# Altium project ESP32_USB_C.PrjPcb
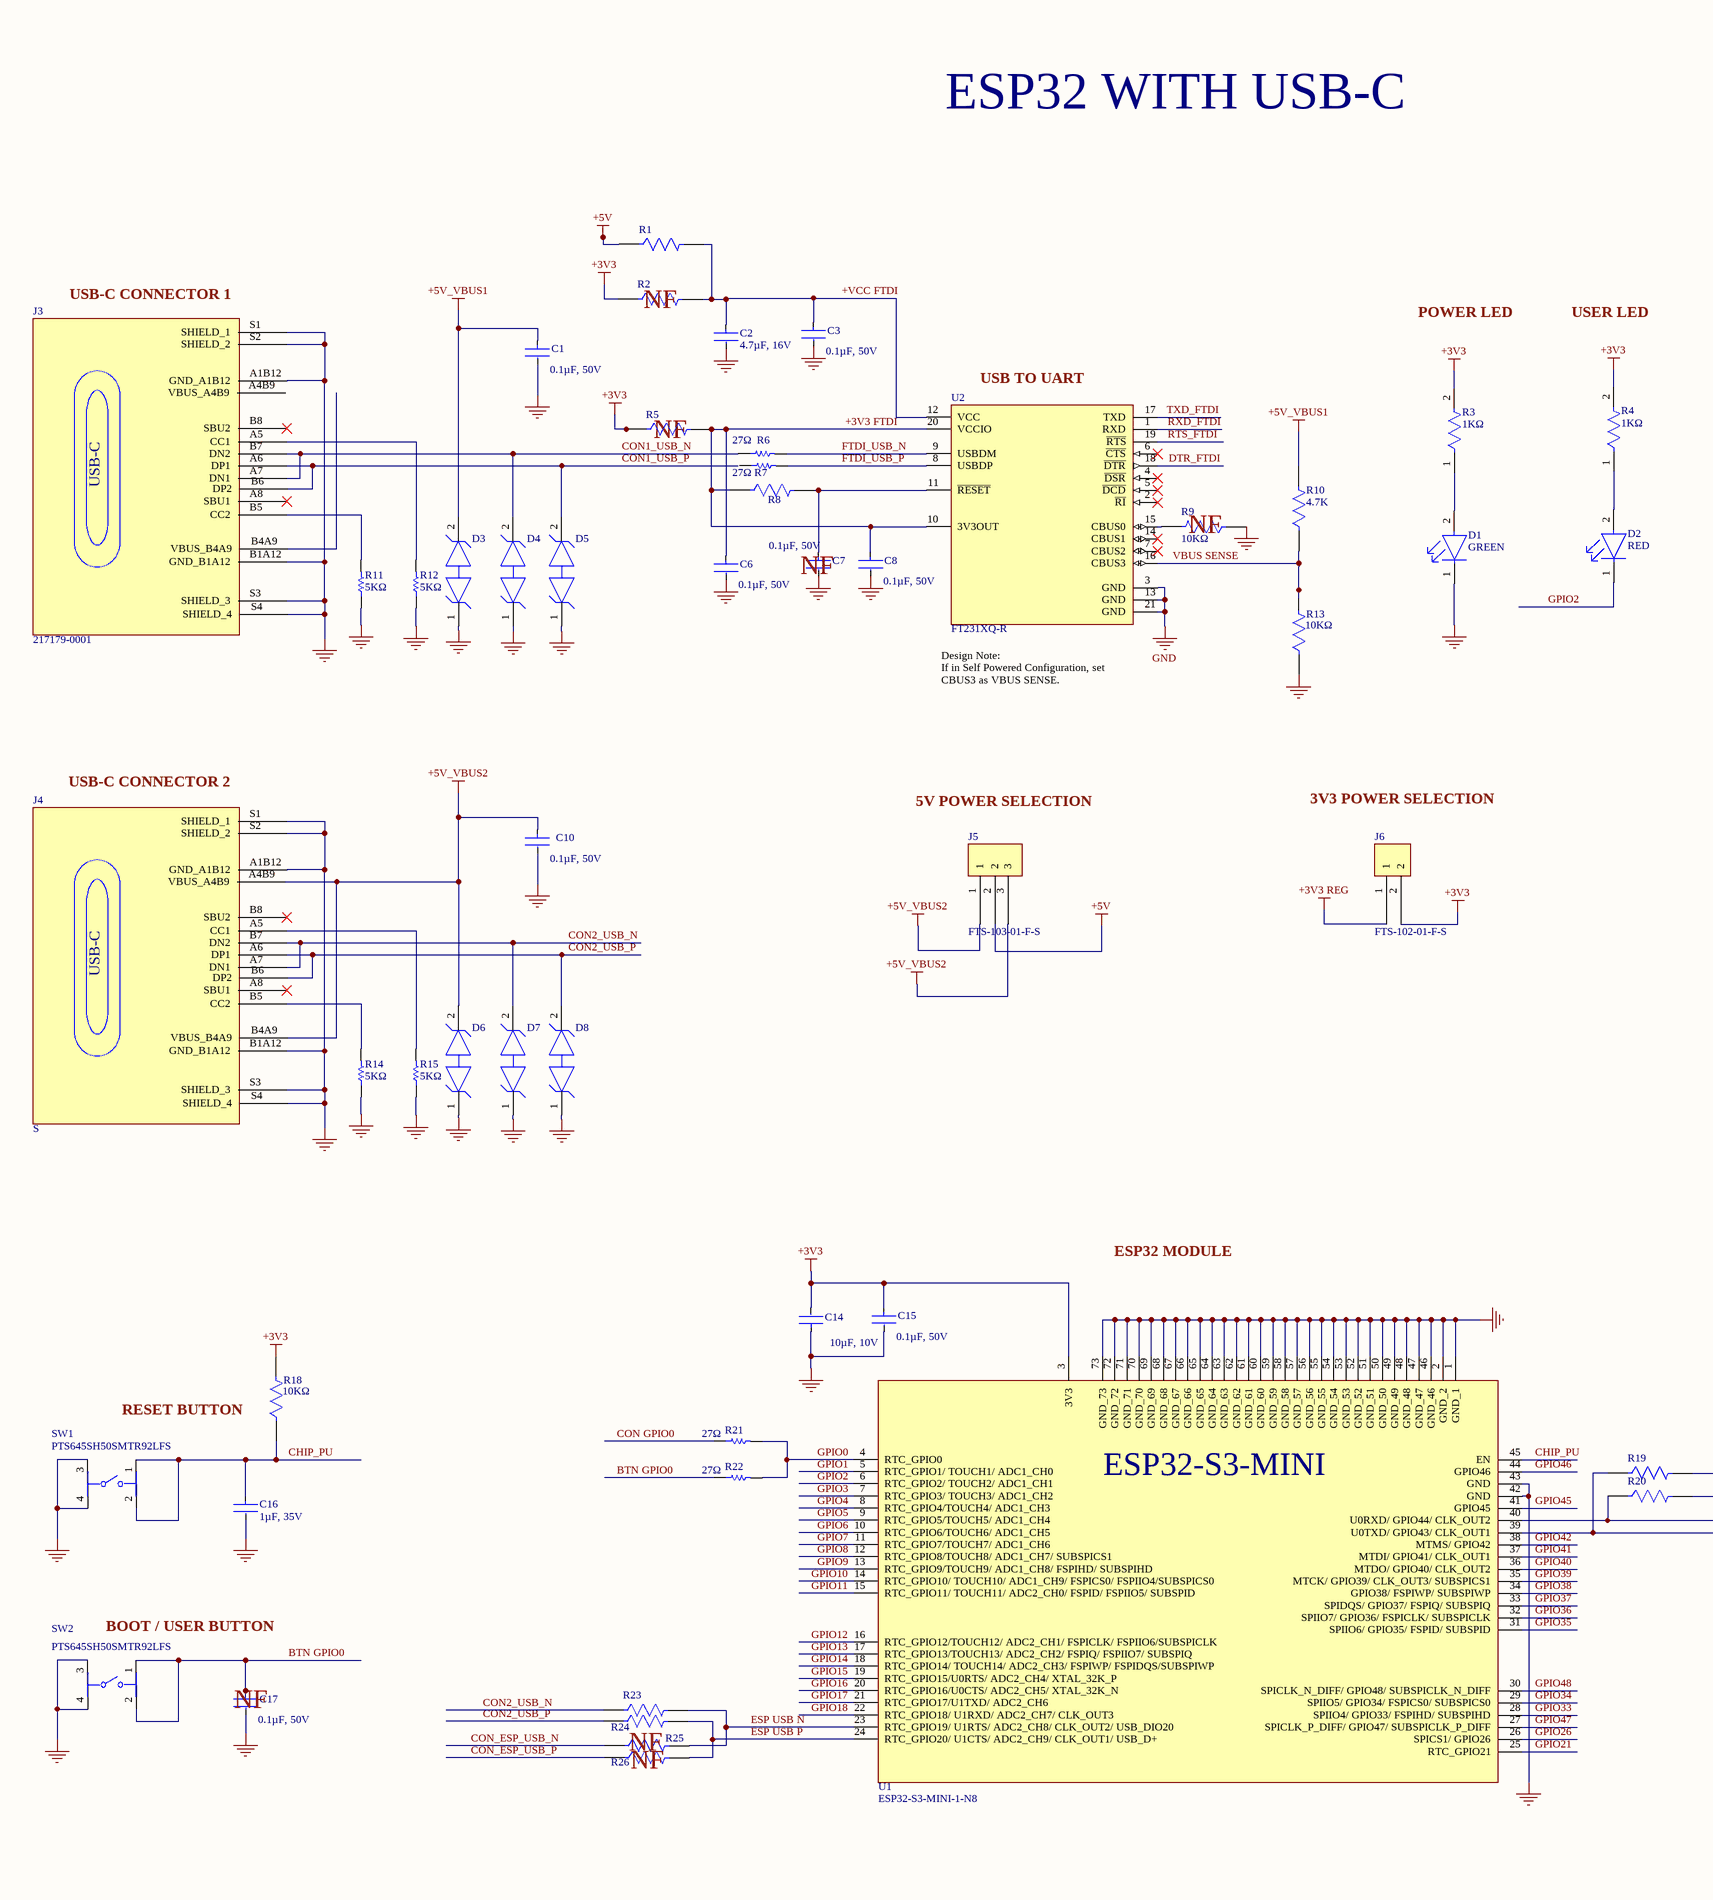
[diagram p0: ESP32_USB_C.SchDoc, left]
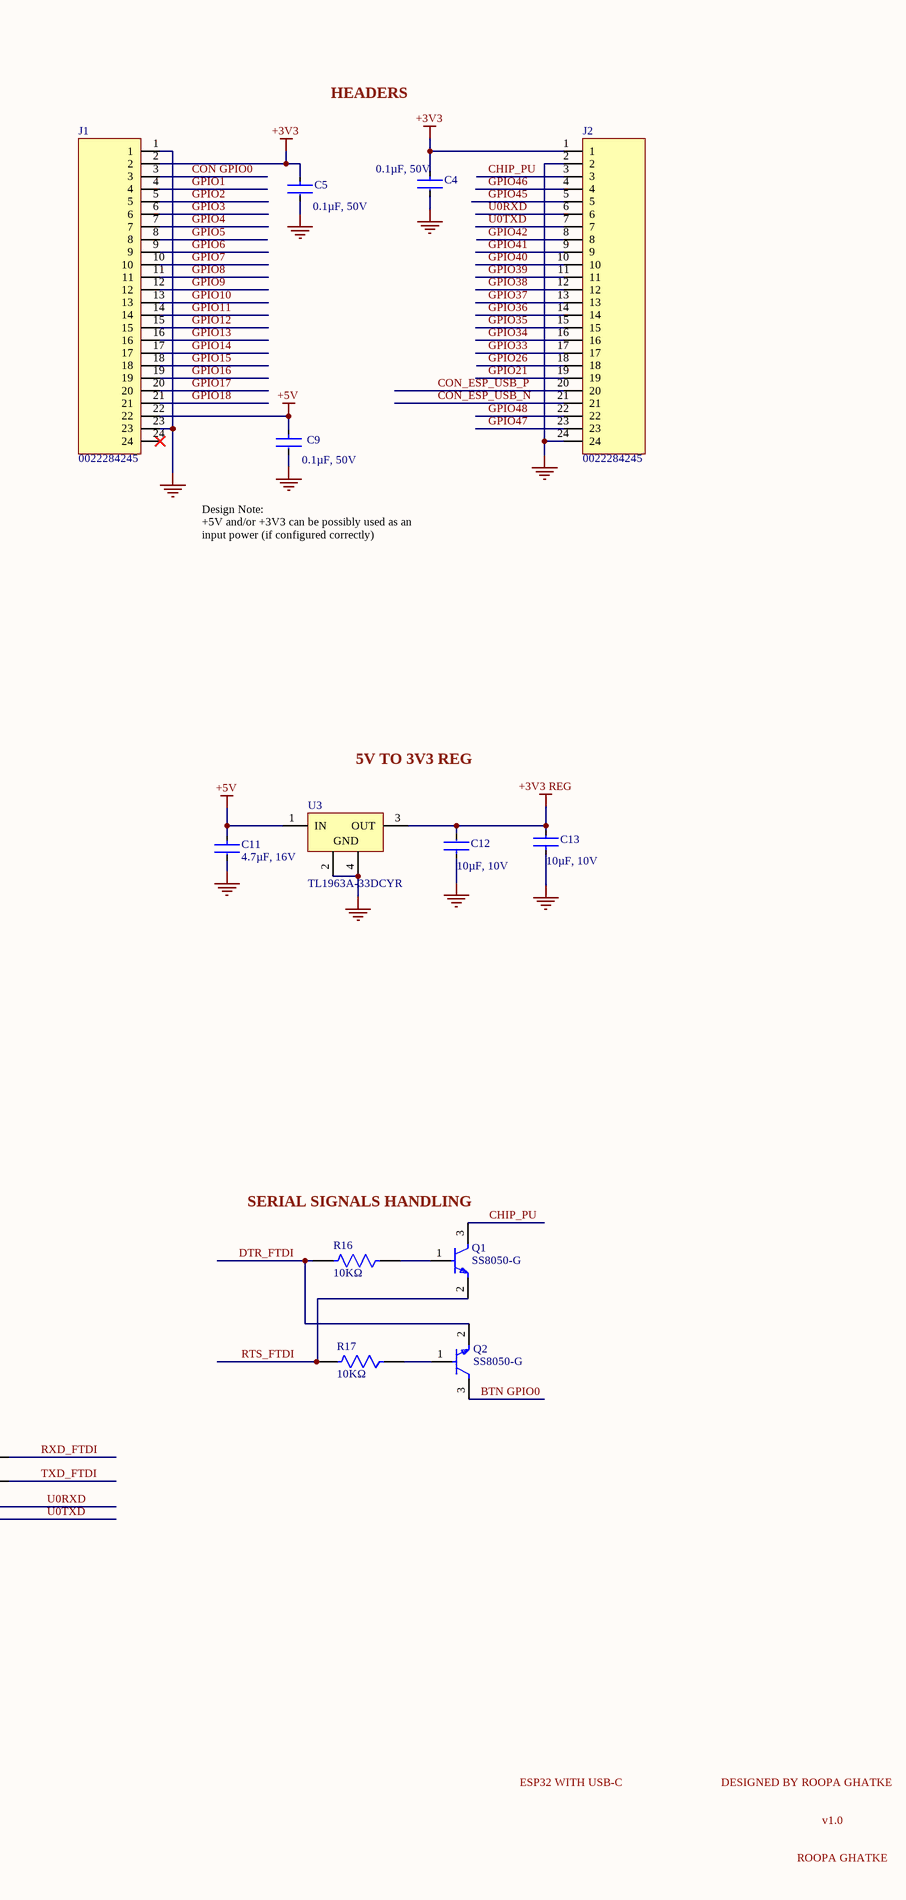
[diagram p1: ESP32_USB_C.SchDoc, right]
1 sheet, 64 parts. Net scope: global (net labels, ports and power ports of the same name join across sheets).
Board file: ESP32_USB_C.PcbDoc

## Sheet ESP32_USB_C.SchDoc: ESP32 WITH USB-C
size A2; DrawnBy: ROOPA GHATKE; Revision: v1.0; SheetNumber: 1; SheetTotal: 1

### Parts
C1  0.1µF, 50V  [FP-CL779-IPC_C]
C2  4.7µF, 16V  [FP-CL829-IPC_C]
C3  0.1µF, 50V  [FP-CL779-IPC_C]
C4  0.1µF, 50V  [FP-CL779-IPC_C]
C5  0.1µF, 50V  [FP-CL779-IPC_C]
C6  0.1µF, 50V  [FP-CL779-IPC_C]
C7  0.1µF, 50V  [FP-CL779-IPC_C]
C8  0.1µF, 50V  [FP-CL779-IPC_C]
C9  0.1µF, 50V  [FP-CL779-IPC_C]
C10  0.1µF, 50V  [FP-CL779-IPC_C]
C11  4.7µF, 16V  [FP-CL829-IPC_C]
C12  10µF, 10V  [FP-CL07-IPC_C]
C13  10µF, 10V  [FP-CL07-IPC_C]
C14  10µF, 10V  [FP-CL07-IPC_C]
C15  0.1µF, 50V  [FP-CL779-IPC_C]
C16  1µF, 35V  [FP-CL440-IPC_C]
C17  0.1µF, 50V  [FP-CL779-IPC_C]
D1  GREEN  [FP-6_541-5056_01-4-MFG]
D2  RED  [FP-SML-P1-MFG]
D3  SD36C-01FTG  [FP-SD-C-MFG]  (value not drawn)
D4  SD36C-01FTG  [FP-SD-C-MFG]  (value not drawn)
D5  SD36C-01FTG  [FP-SD-C-MFG]  (value not drawn)
D6  SD36C-01FTG  [FP-SD-C-MFG]  (value not drawn)
D7  SD36C-01FTG  [FP-SD-C-MFG]  (value not drawn)
D8  SD36C-01FTG  [FP-SD-C-MFG]  (value not drawn)
J1  0022284245  [HRD_1X24_2.54MM]
J2  0022284245  [HRD_1X24_2.54MM]
J3  217179-0001  [MOLEX_2171790001]
J4  S  [MOLEX_2171790001]
J5  FTS-103-01-F-S  [HRD_1X3_1.27MM]
J6  FTS-102-01-F-S  [HRD_1X2_1.27MM]
Q1  SS8050-G  [FP-SS8050-G-MFG]
Q2  SS8050-G  [FP-SS8050-G-MFG]
R1  RC0402FR-070RL  [FP-RC0402-0_4-IPC_A]  (value not drawn)
R2  RC0402FR-070RL  [FP-RC0402-0_4-IPC_A]  (value not drawn)
R3  1KΩ  [FP-RC0402-0_4-IPC_A]
R4  1KΩ  [FP-RC0402-0_4-IPC_A]
R5  RC0402FR-070RL  [FP-RC0402-0_4-IPC_A]  (value not drawn)
R6  27Ω  [RESC1005X40X25LL05T10]
R7  27Ω  [RESC1005X40X25LL05T10]
R8  RC0402FR-070RL  [FP-RC0402-0_4-IPC_A]  (value not drawn)
R9  10KΩ  [FP-AC0402-MFG]
R10  4.7K  [FP-RT0402-MFG]
R11  5KΩ  [RESC1005X40X25NL05T10]
R12  5KΩ  [RESC1005X40X25NL05T10]
R13  10KΩ  [FP-AC0402-MFG]
R14  5KΩ  [RESC1005X40X25NL05T10]
R15  5KΩ  [RESC1005X40X25NL05T10]
R16  10KΩ  [FP-AC0402-MFG]
R17  10KΩ  [FP-AC0402-MFG]
R18  10KΩ  [FP-AC0402-MFG]
R19  RC0402FR-070RL  [FP-RC0402-0_4-IPC_A]  (value not drawn)
R20  RC0402FR-070RL  [FP-RC0402-0_4-IPC_A]  (value not drawn)
R21  27Ω  [RESC1005X40X25LL05T10]
R22  27Ω  [RESC1005X40X25LL05T10]
R23  RC0402FR-070RL  [FP-RC0402-0_4-IPC_A]  (value not drawn)
R24  RC0402FR-070RL  [FP-RC0402-0_4-IPC_A]  (value not drawn)
R25  RC0402FR-070RL  [FP-RC0402-0_4-IPC_A]  (value not drawn)
R26  RC0402FR-070RL  [FP-RC0402-0_4-IPC_A]  (value not drawn)
SW1  PTS645SH50SMTR92LFS  [FP-PTS645SH50SMTR92LFS-MFG]
SW2  PTS645SH50SMTR92LFS  [FP-PTS645SH50SMTR92LFS-MFG]
U1  ESP32-S3-MINI-1-N8  [XCVR_ESP32-S3-MINI-1-N8]
U2  FT231XQ-R  [FP-QFN-20-MFG]
U3  TL1963A-33DCYR  [DCY0004A_N]

### Nets
+3V3: C4.C4 C5.1 C14.2 C15.1 J1.2 J2.1 J6.2 R2.1 R3.2 R4.2 R5.1 R18.2 U1.3(3V3)
+3V3 REG: C12.2 C13.2 J6.1 U3.3(OUT)
+5V: C9.1 C11.1 J1.22 J5.2 R1.1 U3.1(IN)
+5V_VBUS1: C1.C1 D3.2 R10.2
+5V_VBUS2: C10.1 D6.2 J4.A4B9(VBUS_A4B9) J4.B4A9(VBUS_B4A9) J5.1 J5.3
GND: C1.2 C2.2 C3.2 C4.2 C5.2 C6.2 C7.2 C8.2 C9.2 C10.2 C11.2 C12.1 C13.1 C14.1 C15.2 C16.2 C17.2 D1.1(C) D3.1 D4.1 D5.1 D6.1 D7.1 D8.1 J1.1 J1.23 J2.2 J2.24 J3.A1B12(GND_A1B12) J3.B1A12(GND_B1A12) J3.S1(SHIELD_1) J3.S2(SHIELD_2) J3.S3(SHIELD_3) J3.S4(SHIELD_4) J4.A1B12(GND_A1B12) J4.B1A12(GND_B1A12) J4.S1(SHIELD_1) J4.S2(SHIELD_2) J4.S3(SHIELD_3) J4.S4(SHIELD_4) R9.1 R11.1 R12.1 R13.1 R14.1 R15.1 SW1.3 SW1.4 SW2.3 SW2.4 U1.1(GND_1) U1.2(GND_2) U1.42(GND) U1.43(GND) U1.46(GND_46) U1.47(GND_47) U1.48(GND_48) U1.49(GND_49) U1.50(GND_50) U1.51(GND_51) U1.52(GND_52) U1.53(GND_53) U1.54(GND_54) U1.55(GND_55) U1.56(GND_56) U1.57(GND_57) U1.58(GND_58) U1.59(GND_59) U1.60(GND_60) U1.61(GND_61) U1.62(GND_62) U1.63(GND_63) U1.64(GND_64) U1.65(GND_65) U1.66(GND_66) U1.67(GND_67) U1.68(GND_68) U1.69(GND_69) U1.70(GND_70) U1.71(GND_71) U1.72(GND_72) U1.73(GND_73) U2.3(GND) U2.13(GND) U2.21(GND) U3.2(GND) U3.4(GND)
+3V3 FTDI: C6.1 C8.1 R5.2 R8.1 U2.10(3V3OUT) U2.20(VCCIO)
+VCC FTDI: C2.1 C3.1 R1.2 R2.2 U2.12(VCC)
BTN GPIO0: C17.1 Q2.3(C) R22.1 SW2.1 SW2.2
CHIP_PU: C16.1 J2.3 Q1.3(C) R18.1 SW1.1 SW1.2 U1.45(EN)
CON1_USB_N: D4.2 J3.A7(DN1) J3.B7(DN2) R6.1
CON1_USB_P: D5.2 J3.A6(DP1) J3.B6(DP2)
CON2_USB_N: D7.2 J4.A7(DN1) J4.B7(DN2) R23.1
CON2_USB_P: D8.2 J4.A6(DP1) J4.B6(DP2) R24.1
CON GPIO0: J1.3 R21.1
CON_ESP_USB_N: J2.21 R25.1
CON_ESP_USB_P: J2.20 R26.1
DTR_FTDI: Q2.2(E) R16.2 U2.18(~{DTR})
ESP USB N: R23.2 R25.2 U1.23(RTC_GPIO19/_U1RTS/_ADC2_CH8/_CLK_OUT2/_USB_DIO20)
ESP USB P: R24.2 R26.2 U1.24(RTC_GPIO20/_U1CTS/_ADC2_CH9/_CLK_OUT1/_USB_D+)
FTDI_USB_N: R6.2 U2.9(USBDM)
FTDI_USB_P: R7.2 U2.8(USBDP)
GPIO0: R21.2 R22.2 U1.4(RTC_GPIO0)
GPIO1: J1.4 U1.5(RTC_GPIO1/_TOUCH1/_ADC1_CH0)
GPIO2: D2.1(C) J1.5 U1.6(RTC_GPIO2/_TOUCH2/_ADC1_CH1)
GPIO3: J1.6 U1.7(RTC_GPIO3/_TOUCH3/_ADC1_CH2)
GPIO4: J1.7 U1.8(RTC_GPIO4/TOUCH4/_ADC1_CH3)
GPIO5: J1.8 U1.9(RTC_GPIO5/TOUCH5/_ADC1_CH4)
GPIO6: J1.9 U1.10(RTC_GPIO6/TOUCH6/_ADC1_CH5)
GPIO7: J1.10 U1.11(RTC_GPIO7/TOUCH7/_ADC1_CH6)
GPIO8: J1.11 U1.12(RTC_GPIO8/TOUCH8/_ADC1_CH7/_SUBSPICS1)
GPIO9: J1.12 U1.13(RTC_GPIO9/TOUCH9/_ADC1_CH8/_FSPIHD/_SUBSPIHD)
GPIO10: J1.13 U1.14(RTC_GPIO10/_TOUCH10/_ADC1_CH9/_FSPICS0/_FSPIIO4/SUBSPICS0)
GPIO11: J1.14 U1.15(RTC_GPIO11/_TOUCH11/_ADC2_CH0/_FSPID/_FSPIIO5/_SUBSPID)
GPIO12: J1.15 U1.16(RTC_GPIO12/TOUCH12/_ADC2_CH1/_FSPICLK/_FSPIIO6/SUBSPICLK)
GPIO13: J1.16 U1.17(RTC_GPIO13/TOUCH13/_ADC2_CH2/_FSPIQ/_FSPIIO7/_SUBSPIQ)
GPIO14: J1.17 U1.18(RTC_GPIO14/_TOUCH14/_ADC2_CH3/_FSPIWP/_FSPIDQS/SUBSPIWP)
GPIO15: J1.18 U1.19(RTC_GPIO15/U0RTS/_ADC2_CH4/_XTAL_32K_P)
GPIO16: J1.19 U1.20(RTC_GPIO16/U0CTS/_ADC2_CH5/_XTAL_32K_N)
GPIO17: J1.20 U1.21(RTC_GPIO17/U1TXD/_ADC2_CH6)
GPIO18: J1.21 U1.22(RTC_GPIO18/_U1RXD/_ADC2_CH7/_CLK_OUT3)
GPIO21: J2.19 U1.25(RTC_GPIO21)
GPIO26: J2.18 U1.26(SPICS1/_GPIO26)
GPIO33: J2.17 U1.28(SPIIO4/_GPIO33/_FSPIHD/_SUBSPIHD)
GPIO34: J2.16 U1.29(SPIIO5/_GPIO34/_FSPICS0/_SUBSPICS0)
GPIO35: J2.15 U1.31(SPIIO6/_GPIO35/_FSPID/_SUBSPID)
GPIO36: J2.14 U1.32(SPIIO7/_GPIO36/_FSPICLK/_SUBSPICLK)
GPIO37: J2.13 U1.33(SPIDQS/_GPIO37/_FSPIQ/_SUBSPIQ)
GPIO38: J2.12 U1.34(GPIO38/_FSPIWP/_SUBSPIWP)
GPIO39: J2.11 U1.35(MTCK/_GPIO39/_CLK_OUT3/_SUBSPICS1)
GPIO40: J2.10 U1.36(MTDO/_GPIO40/_CLK_OUT2)
GPIO41: J2.9 U1.37(MTDI/_GPIO41/_CLK_OUT1)
GPIO42: J2.8 U1.38(MTMS/_GPIO42)
GPIO45: J2.5 U1.41(GPIO45)
GPIO46: J2.4 U1.44(GPIO46)
GPIO47: J2.23 U1.27(SPICLK_P_DIFF/_GPIO47/_SUBSPICLK_P_DIFF)
GPIO48: J2.22 U1.30(SPICLK_N_DIFF/_GPIO48/_SUBSPICLK_N_DIFF)
RTS_FTDI: Q1.2(E) R17.2 U2.19(~{RTS})
RXD_FTDI: R19.2 U2.1(RXD)
TXD_FTDI: R20.2 U2.17(TXD)
U0RXD: J2.6 R20.1 U1.40(U0RXD/_GPIO44/_CLK_OUT2)
U0TXD: J2.7 R19.1 U1.39(U0TXD/_GPIO43/_CLK_OUT1)
VBUS SENSE: R10.1 R13.2 U2.16(CBUS3)
NetC7_1: C7.1 R8.2 U2.11(~{RESET})
NetD1_2: D1.2(A) R3.1
NetD2_2: D2.2(A) R4.1
NetJ3_A5: J3.A5(CC1) R12.2
NetJ3_B5: J3.B5(CC2) R11.2
NetJ4_A5: J4.A5(CC1) R15.2
NetJ4_B5: J4.B5(CC2) R14.2
NetQ1_1: Q1.1(B) R16.1
NetQ2_1: Q2.1(B) R17.1
NetR9_2: R9.2 U2.15(CBUS0)

Not connected (* = marked no-connect by the designer): J1 24*; J3 A4B9(VBUS_A4B9) A8(SBU1)* B4A9(VBUS_B4A9) B8(SBU2)*; J4 A8(SBU1)* B8(SBU2)*; R7 1; U2 2(~{RI})* 4(~{DSR})* 5(~{DCD})* 6(~{CTS})* 7(CBUS2)* 14(CBUS1)*

### Notes on the sheet
- ESP32 WITH USB-C
- HEADERS
- (near J3) USB-C CONNECTOR 1
- (near R2) NF
- POWER LED
- USER LED
- (near U2) USB TO UART
- (near R5) NF
- (near C7) NF
- (near R9) NF
- Design Note:
  +5V and/or +3V3 can be possibly used as an input power (if configured correctly)
- (near U2) Design Note:
  If in Self Powered Configuration, set CBUS3 as VBUS SENSE.
- (near J4) USB-C CONNECTOR 2
- 5V POWER SELECTION
- 3V3 POWER SELECTION
- 5V TO 3V3 REG
- ESP32 MODULE
- SERIAL SIGNALS HANDLING
- RESET BUTTON
- BOOT / USER BUTTON
- (near C17) NF
- NF
- DESIGNED BY ROOPA GHATKE
- ROOPA GHATKE
- v1.0
- (in symbol 217179-0001) USB-C
- (in symbol ESP32-S3-MINI-1-N8) ESP32-S3-MINI

### Library data of the parts
C1 C3-C10 C15 C17 = CMP-13271-002336-1: Cap Ceramic 100nF 50V X7R ±10% SMD 0402 +125°C Paper T/R
C2 C11 = CMP-13271-001468-1: Cap Ceramic 4.7uF 16V X5R ±20% SMD 0402 +85°C Paper T/R; Mount: Surface Mount; Case Code (Metric): 1005; Case/Package: 0402; Length: 0.039inch; Capacitance: 4.7uF; Voltage Rating: 16V; Max Operating Temperature: 85°C; Tolerance: 20%; Thickness: 0.022inch; Min Operating Temperature: -55°C; Case Code (Imperial): 0402; Packaging: Tape and Reel; Width: 0.02inch
C12-C14 = CMP-13271-002778-1: Cap Ceramic 10uF 10V X5R ±20% SMD 0402 +85°C Paper T/R; Length: 0.039inch; Mount: Surface Mount; Case Code (Imperial): 0402; Capacitance: 10uF; Max Operating Temperature: 85°C; Voltage Rating: 10V; Min Operating Temperature: -55°C; Case/Package: 0402; Thickness: 0.035inch; Width: 0.02inch; Case Code (Metric): 1005; Packaging: Tape and Reel; Tolerance: 20%
C16 = CMP-13271-000031-1: Cap Ceramic 1uF 35V X5R ±10% SMD 0402 +85°C Paper T/R; Voltage Rating: 35V; Mount: Surface Mount; Case Code (Metric): 1005; Thickness: 0.022inch; Capacitance: 1uF; Max Operating Temperature: 85°C; Width: 0.02inch; Tolerance: 10%; Length: 0.039inch; Packaging: Tape and Reel; Case Code (Imperial): 0402; Min Operating Temperature: -55°C; Case/Package: 0402
D1 = CMP-02520-000009-1: LED GREEN 0603 SMD; Manufacturer Part Number: TLMP1100-GS08; Manufacturer: Vishay; Max Junction Temp: +120°C; Automotive Grade: Grade 3; Reverse Voltage: 6V; Led Orientation: Top View; Forward Voltage: 2.1V; Luminous Intensity: 15mcd; Forward Current: 20mA; Colour: Pure green; Peak Emmision Wavelength: 562nm; Wavelength: 561nm; Viewing Angle: 160°; Power Dissipation: 90mW; Digikey Description: LED GREEN 0603 SMD; Package: 6.541-5056.01-4; Ambient Temperature Range High: +100°C; Height: 0.65mm; Device Class L1: Optoelectronics; Device Class L2: LEDs; Mouser Description: Standard LEDs - SMD Pure Green; Temperature Range High: +120°C; RoHS: TRUE; Ambient Temperature Range Low: -40°C; Temperature: to +120°C; ComponentLink2URL: http://www.vishay.com/docs/83173/tlmb1100.pdf; Lead Free: Yes; Octopart: https://octopart.com/tlmp1100-gs08-vishay-55433993; Automotive: Yes; Device Class L3: unset; ComponentLink2Description: Datasheet; Category: Diode
D2 = CMP-08952-000002-1: LED RED CLEAR 0402 SMD; Manufacturer: Rohm; Manufacturer Part Number: SML-P12VTT86R; Wavelength: 630nm; Luminous Intensity: 60mcd; Led Orientation: Top View; Forward Current: 20mA; Reverse Voltage: 5V; Power Dissipation: 50mW; Forward Voltage: 2V; Mouser Description: SML-P1 Series Red 0402 Clear 60 mcd 2V Surface Mount PICOLED? LED; Package: SML-P1; Colour: Red; Temperature Range Low: -40°C; Octopart: https://octopart.com/sml-p12vtt86r-rohm-34112315; Automotive: No; Temperature: -40°C to +85°C; Digikey Description: LED RED CLEAR 0402 SMD; ComponentLink2URL: https://www.rohm.com/datasheet/SML-P12VT(R)/sml-p1-e; Device Class L1: Optoelectronics; Device Class L3: unset; Category: Diode; Temperature Range High: +85°C; ComponentLink2Description: Datasheet; Lead Free: Yes; RoHS: TRUE; Device Class L2: LEDs; Height: 0.25mm
D3-D8 = CMP-08607-000051-1: TVS DIODE 36V 60V SOD323; Manufacturer: Littelfuse; Number Of Channels: 1; Automotive Grade: Grade 1; Standoff Height: 0mm; Direction: Bidirectional; Breakdown Voltage: 40V; Capacitance: 30pF; Peak Pulse Current: 5A; Value: 30pF; Peak Pulse Power: 450W; Device Class L2: TVS Diodes; Height: 1.14mm; Lead Free: Yes; Clamping Voltage: 60V; Package: SD-C; Ipc Land Pattern Name: SOD257130X97-2; Manufacturer Part Number: SD36C-01FTG; Device Class L3: unset; ComponentLink2Description: Datasheet; Octopart: https://octopart.com/sd36c-01ftg-littelfuse-46949624; Category: Diode; Temperature Range High: +125°C; Temperature: -40°C to +125°C; RoHS: TRUE; Temperature Range Low: -40°C; Reverse Standoff Voltage: 36V; Automotive: Yes; Mouser Description: In a Pack of 25, Littelfuse SD36C-01FTG, Bi-Directional TVS Diode Array, 450W, 2-Pin SOD-323; Digikey Description: TVS DIODE 36V 60V SOD323; Device Class L1: Circuit Protection; ComponentLink2URL: https://www.littelfuse.com/~/media/electronics/datasheets/tvs_diode_arrays/littelfuse_tvs_diode_array_sd_c_datasheet.pdf.pdf
J1 J2 = 0022284245: CONN HEADER VERT 24POS 2.54MM; Manufacturer: Molex; Plating: Tin; Current Rating: 4A; Gender: Male; Number of Circuits: 24; Supplier: Digikey; Supplier Part Number: 900-0022284245-ND; Manufacturer Part Number: 22-28-4245; RoHS: No; Category: Headers and Wire Housings; Stock: 1546; Pricing: 1=1.21, 10=1.024, 100=0.8699, 500=0.77638, 1000=0.73932, 5000=0.65998, 10000=0.62851 (USD); Mounting Technology: Through Hole; Contact Material: Brass; Contact Plating: Gold; Housing Color: Black; Number of Contacts: 24; Number of Positions: 24; Number of Rows: 1; Orientation: Vertical; Packaging: Bulk; Termination: Solder; Pitch: 2.54mm; Lead Free: Lead Free; Reach SVHC Compliant: 4188SVHC; ComponentLink1URL: https://datasheet.ciiva.com/6814/022284363-sd-6814049.pdf?src-supplier=Digikey; ComponentLink1Description: https://datasheet.ciiva.com/6814/022284363-sd-6814049.pdf?src-supplier=Digikey; ComponentLink2URL: https://datasheet.ciiva.com/10075/0022284245-pcb-headers-10075617.pdf?src-supplier=Avnet; ComponentLink2Description: https://datasheet.ciiva.com/10075/0022284245-pcb-headers-10075617.pdf?src-supplier=Avnet; ComponentLink3URL: https://datasheet.ciiva.com/1433/1597854-1433759.pdf?src-supplier=Element14; ComponentLink3Description: https://datasheet.ciiva.com/1433/1597854-1433759.pdf?src-supplier=Element14; LCSC Part Number: C7145888
J3 J4 = 217179-0001: USB Connector, USB Type C, USB 2.0, Receptacle, 16 Ways, Surface Mount, Through Hole Mount; Manufacturer: Molex; USB Standard: USB 2.0; Current Rating: 1.25A; Number of Contacts: 16; Voltage Rating: 30V; Supplier: Digikey; Supplier Part Number: 900-2171790001CT-ND; Manufacturer Part Number: 217179-0001; RoHS: No; Category: Connectors; Stock: 21544; Pricing: 1=0.83, 10=0.704, 25=0.6596, 50=0.628, 100=0.598, 250=0.56052, 500=0.53374 (USD); Contact Material: Nickel,Gold; Min Operating Temperature: -40°C; Max Operating Temperature: 85°C; Gender: Receptacle; Height: 3.36mm; LCSC Part Number: C3197684
J5 = FTS-103-01-F-S: CONN HEADER VERT 3POS 1.27MM; LCSC Part Number: C3333578
J6 = FTS-102-01-F-S: CONN HEADER VERT 2POS 1.27MM; LCSC Part Number: C3333578
Q1 Q2 = CMP-20235-000001-1: NPN TRANSISTOR 1.5A 40V SOT-23 R; Transition Frequency: 100MHz; Max Breakdown Voltage: 25V; Collector Emitter Voltage (VCEO): 400mV; Max Power Dissipation: 300mW; Max Collector Current: 1.5A; Case/Package: TO-236-3; Packaging: Tape and Reel; RoHS Compliant: Yes; Mount: Surface Mount; Collector Emitter Breakdown Voltage: 25V
R1 R2 R5 R8 R19 R20 R23-R26 = CMP-2002-07342-2: RES SMD 0 OHM JUMPER 1/16W 0402; Resistance: 0R; Temperature Coefficient: 200ppm/°C; Tolerance: 1%; Power Rating: 62.5mW; Voltage Rating: 50V; Max Power Dissipation: 63mW; Features: Moisture Resistant; Length: 1mm; Case Code (Metric): 1005; Series: RC; RoHS Compliant: Yes; Resistor Type: Thick Film; Height: 0.35mm; Min Operating Temperature: -55°C; Case Code (Imperial): 0402; Number of Terminations: 2; Contact Plating: Tin; Case/Package: 0402; Size Code: 0402; Termination: SMD/SMT; Max Operating Temperature: 155°C; Width: 0.5mm; Mount: Surface Mount; Lead Free: Lead Free; Packaging: Tape and Reel; Radiation Hardening: No
R3 R4 = CMP-2002-07472-3: RES 1K OHM 1% 1/16W 0402; Max Power Dissipation: 63mW; Resistance: 1kR; Voltage Rating (DC): 50V; Temperature Coefficient: 100ppm/°C; Power Rating: 62.5mW; Technology: THICK FILM; Size Code: 0402; Series: RC; Length: 1mm; Case/Package: 0402; Features: Moisture Resistant; Termination: SMD/SMT; Case Code (Metric): 1005; Reach SVHC Compliant: Yes; Number of Terminations: 2; Tolerance: 1%; Lead Free: Lead Free; Military Standard: Not; Resistor Type: Thick Film; Max Operating Temperature: 155°C; RoHS Compliant: Yes; Construction: Rectangular; Voltage Rating: 50V; Packaging: Tape and Reel; Height: 0.32mm; Number of Pins: 2; Resistance Tolerance: 1%; Case Code (Imperial): 0402; Depth: 0.5mm; Min Operating Temperature: -55°C; Width: 0.5mm
R6 R7 R21 R22 = CMP-2002-07055-1: Part Number: RC0402FR-0727RL; Manufacturer: Yageo / Phycomp
R9 R13 R16-R18 = CMP-2002-01790-3: RES 10kΩ ±1% 0.063W 0402; Power Rating: 62.5mW; Voltage Rating: 50V; Temperature Coefficient: 100ppm/°C; Resistance: 10kR; Max Power Dissipation: 63mW; Tolerance: 1%; Military Standard: Not; Construction: Rectangular; Termination: SMD/SMT; Max Operating Temperature: 155°C; Min Operating Temperature: -55°C; Height: 0.015inch; Lead Free: Lead Free; Width: 0.02inch; Case/Package: 0402; Resistor Type: Thick Film; Series: AC; Features: Moisture Resistant; RoHS Compliant: Yes; Number of Terminations: 2; Case Code (Metric): 1005; Length: 0.039inch; Depth: 0.5mm; Size Code: 0402; Packaging: Tape and Reel; Case Code (Imperial): 0402
R10 = CMP-03412-002579-1: RES SMD 4.7K OHM 0.1% 1/16W 0402; Manufacturer: Yageo; Manufacturer Part Number: RT0402BRB074K7L; Tolerance: 0.001; Temperature Coefficient: 10 ppm/°C; Voltage Rating: 50V; Power Rating: 0.063W; Value: 4.7KΩ; Lead Free: Yes; Digikey Description: RES SMD 4.7K OHM 0.1% 1/16W 0402; Octopart: https://octopart.com/rt0402brb074k7l-yageo-71392583; Series: RT; Device Class L2: Resistors; Height: 0.35mm; Package: RT0402; Device Class L3: Chip SMD Resistors; ComponentLink2Description: Datasheet; Device Class L1: Passive Components; Temperature Range High: +155°C; Temperature: -55°C to +155°C; Footprint Url: http://www.yageo.com/exep/pages/download/literatures/PYu-R_Mount_10.pdf; RoHS: TRUE; Automotive: No; Temperature Range Low: -55°C; Composition: Thin Film; Category: Res; Ipc Land Pattern Name: RESC10050X30; ComponentLink2URL: http://www.yageo.com/documents/recent/PYu-RT_1-to-0.01_RoHS_L_9.pdf; Mouser Description: Thin Film Resistors 1/16W 4.7K ohm .1% 10ppm; Resistance: 4.7KΩ
R11 R12 R14 R15 = CMP-2002-07753-1: Part Number: RC0402FR-075K1L; Manufacturer: Yageo / Phycomp
SW1 SW2 = CMP-10040-000028-1: SWITCH TACTILE SPST-NO 0.05A 12V; Operating Force: 200gf; Current Rating: 50mA; Illumination Type: Non-Illuminated; Actuator Material: Nylon; Throw Configuration: SPST; Switch Function: Off-Mom; Mechanical Life: 100000Cycles; Actuator Type: Standard; Packaging: Tape and Reel; Termination: Gull Wing; Max Operating Temperature: 60°C; Length: 6mm; REACH SVHC: No SVHC; Orientation: Straight; Max Voltage Rating (DC): 12V; Package Quantity: 1000; Max Current Rating: 50mA; Mount: Surface Mount; Contact Material: Bronze; Case/Package: SMD/SMT; Lead Free: Lead Free; Min Operating Temperature: -20°C; Contact Plating: Silver; Color: Black; Depth: 9mm; Voltage Rating (DC): 12V
U1 = ESP32-S3-MINI-1-N8: SMD module, ESP32-S3FN8, 8 MB SPI flash, PCB antenna; Manufacturer: Espressif Systems; Supplier: Mouser; Supplier Part Number: 356-ESP32-S3-MINI1N8; Manufacturer Part Number: ESP32-S3-MINI-1-N8; RoHS: No; Category: LDO; Stock: 9784; Pricing: 1=6.15, 10=5.5, 50=4.31, 100=4.19, 1000=3.65, 10000=3.44 (USD); ComponentLink1URL: https://datasheet.octopart.com/ESP32-S3-MINI-1-N8-Espressif-Systems-datasheet-188867343.pdf?src-supplier=TME; ComponentLink1Description: https://datasheet.octopart.com/ESP32-S3-MINI-1-N8-Espressif-Systems-datasheet-188867343.pdf?src-supplier=TME; LCSC Part Number: C2913206
U2 = CMP-0248-00001-3: IC USB SERIAL FULL UART 20QFN; Data Rate: 12Mbps; Operating Supply Current: 8mA; Min Supply Voltage: 2.97V; Max Supply Voltage: 5.5V; Number of Channels: 1; Min Operating Temperature: -40°C; Case/Package: QFN; Mount: Surface Mount; Number of Pins: 20; Interface: UART; Lead Free: Lead Free; Package Quantity: 5000; Weight: 0.004339oz; Packaging: Tape and Reel; Max Operating Temperature: 85°C
U3 = CMP-0395-00535-2: Single Output Low Noise LDO, 1.5 A, Fixed 3.3 V Output, 2.1 to 20 V Input, 4-pin SOT-223 (DCY), -40 to 125 degC, Green (RoHS & no Sb/Br); Manufacturer: Texas Instruments; Vout Adj(Min)(V): 3.3; Vin(Max)(V): 20; SubFamily: Single Channel LDO; Iq(Typ)(mA): 1; Iout(Max)(A): 1.5; Vin(Min)(V): 2.1; Vdo(Typ)(mV): 340; Accuracy(%): 3; ComponentLink2Description: Datasheet; PackageVersion: 4202506/B; PackageReference: DCY0004A; ComponentLink1Description: Manufacturer URL; Eco-Plan: Green (RoHS & no Sb/Br); ComponentLink1URL: http://www.ti.com/; Fixed Output Options(V): 3.3; ComponentLink2URL: http://www.ti.com/general/docs/lit/getliterature.tsp?genericPartNumber=TL1963A-33&fileType=pdf; Vout Adj(Max)(V): 3.3; PackageDescription: 4-Pin Plastic Small Outline, Body 3.5 x 6.5 mm, Pitch 2.3 mm; ComponentLink3URL: http://www.ti.com/litv/pdf/mpds094a; DatasheetVersion: SLVS719F; PartNumber: TL1963A-33DCYR; Code_JEDEC: TO-261; Mounting Technology: Surface Mount; ComponentLink3Description: Package Specification

## Assembly variants
Prototype: not fitted C7 C17 R2 R5 R9 R25 R26